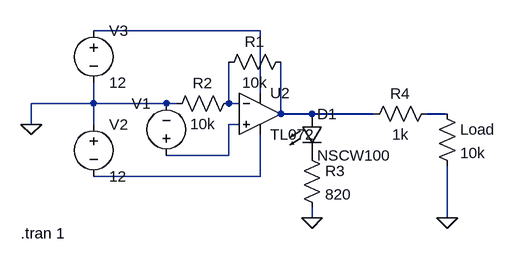
[diagram p0: schematic GateDelayOutput.asc]
GateDelayOutput.asc, the LTspice schematic file:
Version 4
SHEET 1 880 680
WIRE 496 48 240 48
WIRE 496 144 496 48
WIRE 240 160 240 128
WIRE 240 160 144 160
WIRE 352 160 240 160
WIRE 368 160 352 160
WIRE 448 160 448 96
WIRE 464 160 448 160
WIRE 528 176 528 96
WIRE 576 176 528 176
WIRE 672 176 576 176
WIRE 784 176 752 176
WIRE 144 192 144 160
WIRE 240 192 240 160
WIRE 464 192 448 192
WIRE 448 240 448 192
WIRE 448 240 352 240
WIRE 496 272 496 208
WIRE 496 272 240 272
WIRE 576 336 576 320
WIRE 784 336 784 256
FLAG 144 192 0
FLAG 576 336 0
FLAG 784 336 0
SYMBOL voltage 352 256 R180
WINDOW 0 24 96 Left 2
WINDOW 3 24 16 Invisible 2
WINDOW 123 0 0 Left 0
WINDOW 39 0 0 Left 0
SYMATTR InstName V1
SYMATTR Value PULSE(0 5 0 0.001 0.001 0.02 0.1)
SYMBOL voltage 240 176 R0
WINDOW 123 0 0 Left 0
WINDOW 39 0 0 Left 0
SYMATTR InstName V2
SYMATTR Value 12
SYMBOL voltage 240 32 R0
WINDOW 123 0 0 Left 0
WINDOW 39 0 0 Left 0
SYMATTR InstName V3
SYMATTR Value 12
SYMBOL OpAmps\\TL072 496 112 R0
SYMATTR InstName U2
SYMBOL res 544 80 R90
WINDOW 0 0 56 VBottom 2
WINDOW 3 32 56 VTop 2
SYMATTR InstName R1
SYMATTR Value 10k
SYMBOL res 464 144 R90
WINDOW 0 0 56 VBottom 2
WINDOW 3 32 56 VTop 2
SYMATTR InstName R2
SYMATTR Value 10k
SYMBOL LED 560 176 R0
SYMATTR InstName D1
SYMATTR Value NSCW100
SYMATTR Description Diode
SYMATTR Type diode
SYMBOL res 560 224 R0
SYMATTR InstName R3
SYMATTR Value 820
SYMBOL res 768 160 R90
WINDOW 0 0 56 VBottom 2
WINDOW 3 32 56 VTop 2
SYMATTR InstName R4
SYMATTR Value 1k
SYMBOL res 768 160 R0
SYMATTR InstName Load
SYMATTR Value 10k
TEXT 128 360 Left 2 !.tran 1

The netlist it stands for:
* GateDelayOutput.asc
V1 N005 0 PULSE(0 5 0 0.001 0.001 0.02 0.1)
V2 0 N006 12
V3 N001 0 12
XU2 N005 N002 N001 N006 N003 TL072  ; pins In+ In- V+ V- OUT
R1 N003 N002 10k
R2 N002 0 10k
D1 N003 P001 NSCW100
R3 P001 0 820
R4 N004 N003 1k
R§Load N004 0 10k
.model D D
.lib standard.dio
.tran 1
.backanno
.end